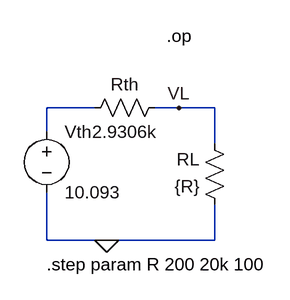
[diagram p0: schematic online lab02 task05.asc]
online lab02 task05.asc, the LTspice schematic file:
Version 4
SHEET 1 880 680
WIRE 144 112 80 112
WIRE 256 112 224 112
WIRE 304 112 256 112
WIRE 80 144 80 112
WIRE 304 160 304 112
WIRE 80 288 80 224
WIRE 160 288 80 288
WIRE 304 288 304 240
WIRE 304 288 160 288
FLAG 256 112 VL
FLAG 160 288 0
SYMBOL voltage 80 128 R0
WINDOW 123 0 0 Left 0
WINDOW 39 0 0 Left 0
SYMATTR InstName Vth
SYMATTR Value 10.093
SYMBOL res 128 128 R270
WINDOW 0 32 56 VTop 2
WINDOW 3 0 56 VBottom 2
SYMATTR InstName Rth
SYMATTR Value 2.9306k
SYMBOL res 320 256 R180
WINDOW 0 36 76 Left 2
WINDOW 3 36 40 Left 2
SYMATTR InstName RL
SYMATTR Value {R}
TEXT 80 320 Left 2 !.step param R 200 20k 100
TEXT 240 16 Left 2 !.op

The netlist it stands for:
* online lab02 task05.asc
Vth N001 0 10.093
Rth N001 VL 2.9306k
RL 0 VL {R}
.step param R 200 20k 100
.op
.backanno
.end